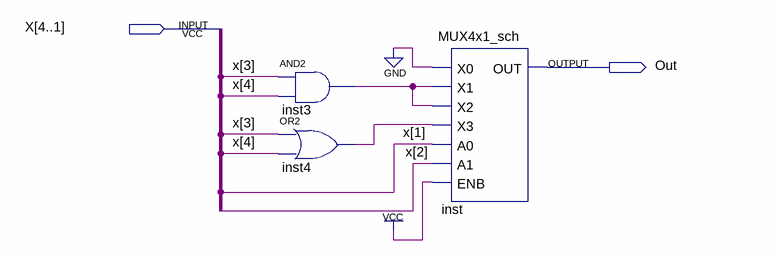
[diagram p0: schematic sheet]
// Quartus schematic FunFunction.bdf as structural Verilog: 3 symbols, 2 pins
module FunFunction (
  input  [4:1] X,
  output Out
);

  wire inst3_out, inst4_out;

  and inst3 (inst3_out, X[3], X[4]);
  or inst4 (inst4_out, X[3], X[4]);
  MUX4x1_sch inst (
    .X0(1'b0), .X1(inst3_out), .X2(inst3_out), .X3(inst4_out), .A0(X[1]), .A1(X[2]), .ENB(1'b1), .OUT(Out));
endmodule
